# EAGLE design Hometech2 (EAGLE 5.12)
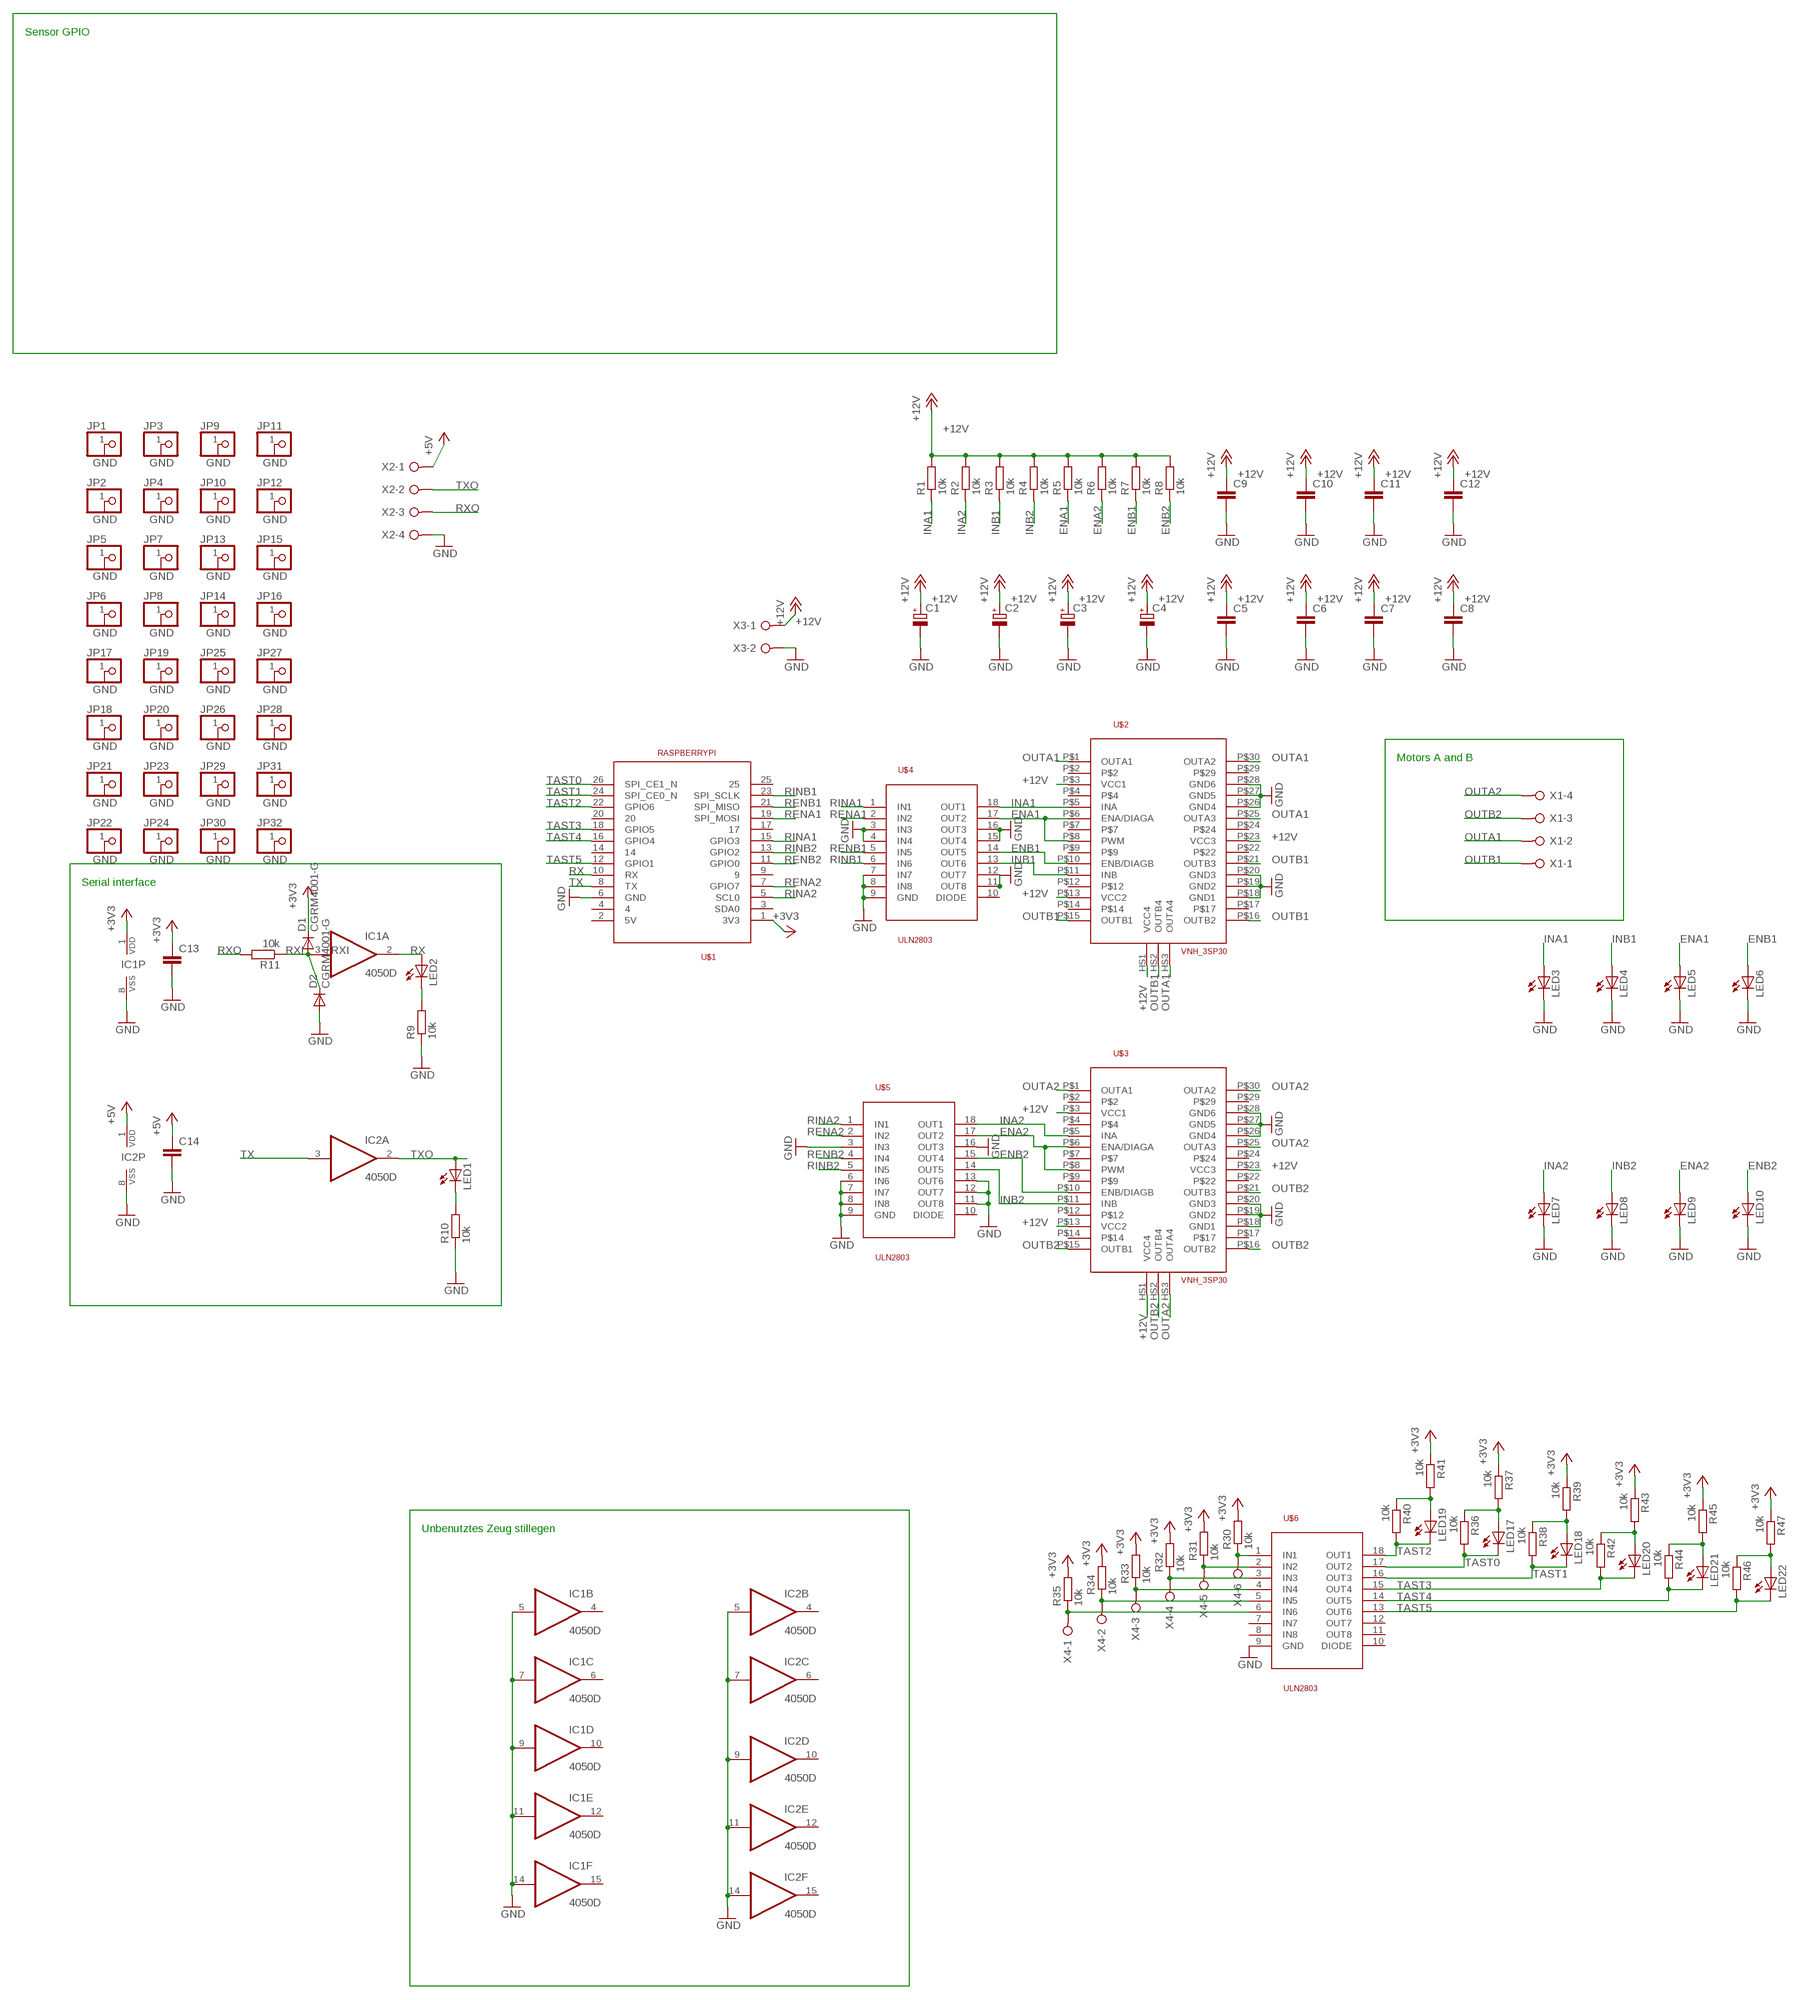
[diagram p0: schematic, sheet 1]

## Parts
C1  CPOL-EUE5-10.5  [E5-10,5]
C2  CPOL-EUE5-10.5  [E5-10,5]
C3  CPOL-EUE5-10.5  [E5-10,5]
C4  CPOL-EUE5-10.5  [E5-10,5]
C5  C-EUC1206  [C1206]
C6  C-EUC1206  [C1206]
C7  C-EUC1206  [C1206]
C8  C-EUC1206  [C1206]
C9  C-EUC1206  [C1206]
C10  C-EUC1206  [C1206]
C11  C-EUC1206  [C1206]
C12  C-EUC1206  [C1206]
C13  C-EUC1206  [C1206]
C14  C-EUC1206  [C1206]
D1  CGRM4001-G  [SOD-123_MINI-SMA]
D2  CGRM4001-G  [SOD-123_MINI-SMA]
IC1  4050D  [SO16]
IC2  4050D  [SO16]
JP1  PINHD-1X1  [1X01]
JP2  PINHD-1X1  [1X01]
JP3  PINHD-1X1  [1X01]
JP4  PINHD-1X1  [1X01]
JP5  PINHD-1X1  [1X01]
JP6  PINHD-1X1  [1X01]
JP7  PINHD-1X1  [1X01]
JP8  PINHD-1X1  [1X01]
JP9  PINHD-1X1  [1X01]
JP10  PINHD-1X1  [1X01]
JP11  PINHD-1X1  [1X01]
JP12  PINHD-1X1  [1X01]
JP13  PINHD-1X1  [1X01]
JP14  PINHD-1X1  [1X01]
JP15  PINHD-1X1  [1X01]
JP16  PINHD-1X1  [1X01]
JP17  PINHD-1X1  [1X01]
JP18  PINHD-1X1  [1X01]
JP19  PINHD-1X1  [1X01]
JP20  PINHD-1X1  [1X01]
JP21  PINHD-1X1  [1X01]
JP22  PINHD-1X1  [1X01]
JP23  PINHD-1X1  [1X01]
JP24  PINHD-1X1  [1X01]
JP25  PINHD-1X1  [1X01]
JP26  PINHD-1X1  [1X01]
JP27  PINHD-1X1  [1X01]
JP28  PINHD-1X1  [1X01]
JP29  PINHD-1X1  [1X01]
JP30  PINHD-1X1  [1X01]
JP31  PINHD-1X1  [1X01]
JP32  PINHD-1X1  [1X01]
LED1  LEDCHIPLED_1206  [CHIPLED_1206]
LED2  LEDCHIPLED_1206  [CHIPLED_1206]
LED3  LEDCHIPLED_1206  [CHIPLED_1206]
LED4  LEDCHIPLED_1206  [CHIPLED_1206]
LED5  LEDCHIPLED_1206  [CHIPLED_1206]
LED6  LEDCHIPLED_1206  [CHIPLED_1206]
LED7  LEDCHIPLED_1206  [CHIPLED_1206]
LED8  LEDCHIPLED_1206  [CHIPLED_1206]
LED9  LEDCHIPLED_1206  [CHIPLED_1206]
LED10  LEDCHIPLED_1206  [CHIPLED_1206]
LED17  LEDCHIPLED_1206  [CHIPLED_1206]
LED18  LEDCHIPLED_1206  [CHIPLED_1206]
LED19  LEDCHIPLED_1206  [CHIPLED_1206]
LED20  LEDCHIPLED_1206  [CHIPLED_1206]
LED21  LEDCHIPLED_1206  [CHIPLED_1206]
LED22  LEDCHIPLED_1206  [CHIPLED_1206]
R1  10k  R-EU_R1206  [R1206]
R2  10k  R-EU_R1206  [R1206]
R3  10k  R-EU_R1206  [R1206]
R4  10k  R-EU_R1206  [R1206]
R5  10k  R-EU_R1206  [R1206]
R6  10k  R-EU_R1206  [R1206]
R7  10k  R-EU_R1206  [R1206]
R8  10k  R-EU_R1206  [R1206]
R9  10k  R-EU_R1206  [R1206]
R10  10k  R-EU_R1206  [R1206]
R11  10k  R-EU_R1206  [R1206]
R30  10k  R-EU_R1206  [R1206]
R31  10k  R-EU_R1206  [R1206]
R32  10k  R-EU_R1206  [R1206]
R33  10k  R-EU_R1206  [R1206]
R34  10k  R-EU_R1206  [R1206]
R35  10k  R-EU_R1206  [R1206]
R36  10k  R-EU_R1206  [R1206]
R37  10k  R-EU_R1206  [R1206]
R38  10k  R-EU_R1206  [R1206]
R39  10k  R-EU_R1206  [R1206]
R40  10k  R-EU_R1206  [R1206]
R41  10k  R-EU_R1206  [R1206]
R42  10k  R-EU_R1206  [R1206]
R43  10k  R-EU_R1206  [R1206]
R44  10k  R-EU_R1206  [R1206]
R45  10k  R-EU_R1206  [R1206]
R46  10k  R-EU_R1206  [R1206]
R47  10k  R-EU_R1206  [R1206]
U$1  RASPBERRYPI  [ML26]
U$2  VNH_3SP30  [POWERSO30]
U$3  VNH_3SP30  [POWERSO30]
U$4  ULN2803  [SO18L]
U$5  ULN2803  [SO18L]
U$6  ULN2803  [SO18L]
X1  W237-04P  [W237-4P]
X2  W237-04P  [W237-4P]
X3  W237-02P  [W237-132]
X4  W237-06P  [W237-6P]

## Nets
+3V3: C13.1 D1.C IC1.1(P:VDD) R30.2 R31.2 R32.2 R33.2 R34.2 R35.2 R37.1 R39.1 R41.1 R43.1 R45.1 R47.1 U$1.1(3V3)
+5V: C14.1 IC2.1(P:VDD) X2.1
+12V: C1.+ C2.+ C3.+ C4.+ C5.1 C6.1 C7.1 C8.1 C9.1 C10.1 C11.1 C12.1 R1.2 R2.2 R3.2 R4.2 R5.2 R6.2 R7.2 R8.2 U$2.HS1(VCC4) U$2.P$3(VCC1) U$2.P$13(VCC2) U$2.P$23(VCC3) U$3.HS1(VCC4) U$3.P$3(VCC1) U$3.P$13(VCC2) U$3.P$23(VCC3) X3.1
ENA1: LED5.A R5.1 U$2.P$6(ENA/DIAGA) U$2.P$8(PWM) U$4.17(OUT2)
ENA2: LED9.A R6.1 U$3.P$6(ENA/DIAGA) U$3.P$8(PWM) U$5.17(OUT2)
ENB1: LED6.A R7.1 U$2.P$10(ENB/DIAGB) U$4.14(OUT5)
ENB2: LED10.A R8.1 U$3.P$10(ENB/DIAGB) U$5.15(OUT4)
GND: C1.- C2.- C3.- C4.- C5.2 C6.2 C7.2 C8.2 C9.2 C10.2 C11.2 C12.2 C13.2 C14.2 D2.A IC1.5(B:I) IC1.7(C:I) IC1.8(P:VSS) IC1.9(D:I) IC1.11(E:I) IC1.14(F:I) IC2.5(B:I) IC2.7(C:I) IC2.8(P:VSS) IC2.9(D:I) IC2.11(E:I) IC2.14(F:I) JP1.1 JP2.1 JP3.1 JP4.1 JP5.1 JP6.1 JP7.1 JP8.1 JP9.1 JP10.1 JP11.1 JP12.1 JP13.1 JP14.1 JP15.1 JP16.1 JP17.1 JP18.1 JP19.1 JP20.1 JP21.1 JP22.1 JP23.1 JP24.1 JP25.1 JP26.1 JP27.1 JP28.1 JP29.1 JP30.1 JP31.1 JP32.1 LED3.C LED4.C LED5.C LED6.C LED7.C LED8.C LED9.C LED10.C R9.1 R10.1 U$1.6(GND) U$2.P$18(GND1) U$2.P$19(GND2) U$2.P$20(GND3) U$2.P$26(GND4) U$2.P$27(GND5) U$2.P$28(GND6) U$3.P$18(GND1) U$3.P$19(GND2) U$3.P$20(GND3) U$3.P$26(GND4) U$3.P$27(GND5) U$3.P$28(GND6) U$4.3(IN3) U$4.4(IN4) U$4.7(IN7) U$4.8(IN8) U$4.9(GND) U$4.11(OUT8) U$4.12(OUT7) U$4.15(OUT4) U$4.16(OUT3) U$5.3(IN3) U$5.6(IN6) U$5.7(IN7) U$5.8(IN8) U$5.9(GND) U$5.11(OUT8) U$5.12(OUT7) U$5.13(OUT6) U$5.16(OUT3) U$6.9(GND) X2.4 X3.2
INA1: LED3.A R1.1 U$2.P$5(INA) U$4.18(OUT1)
INA2: LED7.A R2.1 U$3.P$5(INA) U$5.18(OUT1)
INB1: LED4.A R3.1 U$2.P$11(INB) U$4.13(OUT6)
INB2: LED8.A R4.1 U$3.P$11(INB) U$5.14(OUT5)
N$4: LED2.C R9.2
N$5: LED1.C R10.2
N$28: R30.1 U$6.1(IN1) X4.6
N$29: R31.1 U$6.2(IN2) X4.5
N$30: R32.1 U$6.3(IN3) X4.4
N$31: R33.1 U$6.4(IN4) X4.3
N$32: R34.1 U$6.5(IN5) X4.2
N$33: R35.1 U$6.6(IN6) X4.1
N$34: LED17.A R36.1 R37.2
N$36: LED18.A R38.1 R39.2
N$38: LED19.A R40.1 R41.2
N$40: LED20.A R42.1 R43.2
N$42: LED21.A R44.1 R45.2
N$44: LED22.A R46.1 R47.2
OUTA1: U$2.HS3(OUTA4) U$2.P$1(OUTA1) U$2.P$25(OUTA3) U$2.P$30(OUTA2) X1.2
OUTA2: U$3.HS3(OUTA4) U$3.P$1(OUTA1) U$3.P$25(OUTA3) U$3.P$30(OUTA2) X1.4
OUTB1: U$2.HS2(OUTB4) U$2.P$15(OUTB1) U$2.P$16(OUTB2) U$2.P$21(OUTB3) X1.1
OUTB2: U$3.HS2(OUTB4) U$3.P$15(OUTB1) U$3.P$16(OUTB2) U$3.P$21(OUTB3) X1.3
RENA1: U$1.19(SPI_MOSI) U$4.2(IN2)
RENA2: U$1.7(GPIO7) U$5.2(IN2)
RENB1: U$1.21(SPI_MISO) U$4.5(IN5)
RENB2: U$1.11(GPIO0) U$5.4(IN4)
RINA1: U$1.15(GPIO3) U$4.1(IN1)
RINA2: U$1.5(SCL0) U$5.1(IN1)
RINB1: U$1.23(SPI_SCLK) U$4.6(IN6)
RINB2: U$1.13(GPIO2) U$5.5(IN5)
RX: IC1.2(A:O) LED2.A U$1.10(RX)
RXI: D1.A D2.C IC1.3(A:I) R11.1
RXO: R11.2 X2.3
TAST0: LED17.C R36.2 U$1.26(SPI_CE1_N) U$6.17(OUT2)
TAST1: LED18.C R38.2 U$1.24(SPI_CE0_N) U$6.16(OUT3)
TAST2: LED19.C R40.2 U$1.22(GPIO6) U$6.18(OUT1)
TAST3: LED20.C R42.2 U$1.18(GPIO5) U$6.15(OUT4)
TAST4: LED21.C R44.2 U$1.16(GPIO4) U$6.14(OUT5)
TAST5: LED22.C R46.2 U$1.12(GPIO1) U$6.13(OUT6)
TX: IC2.3(A:I) U$1.8(TX)
TXO: IC2.2(A:O) LED1.A X2.2
Unconnected: IC1.4(B:O) IC1.6(C:O) IC1.10(D:O) IC1.12(E:O) IC1.15(F:O) IC2.4(B:O) IC2.6(C:O) IC2.10(D:O) IC2.12(E:O) IC2.15(F:O) U$1.2(5V) U$1.3(SDA0) U$1.4 U$1.9 U$1.14 U$1.17 U$1.20 U$1.25 U$2.P$2 U$2.P$4 U$2.P$7 U$2.P$9 U$2.P$12 U$2.P$14 U$2.P$17 U$2.P$22 U$2.P$24 U$2.P$29 U$3.P$2 U$3.P$4 U$3.P$7 U$3.P$9 U$3.P$12 U$3.P$14 U$3.P$17 U$3.P$22 U$3.P$24 U$3.P$29 U$4.10(DIODE) U$5.10(DIODE) U$6.7(IN7) U$6.8(IN8) U$6.10(DIODE) U$6.11(OUT8) U$6.12(OUT7)

## Notes on the sheet
- Sensor GPIO
- Motors A and B
- Serial interface
- Unbenutztes Zeug stillegen

## Library data of the parts
C1-C4 = rcl:CPOL-EU: POLARIZED CAPACITOR, European symbol
C5-C14 = rcl:C-EU: CAPACITOR, European symbol
D1 D2 = diode:CGRM400*-G: Molded plasitc,JEDEC SOD-123/Mini SMA Source: Comchip CGRM4001-G.pdf
IC1 IC2 = 40xx:4050: Hex non-inverting BUFFER
JP1-JP32 = via:PINHD-1X1: VIA
LED1-LED10 LED17-LED22 = led:LED: LED OSRAM: - CHIPLED LG R971, LG N971, LY N971, LG Q971, LY Q971, LO R971, LY R971 LH N974, LH R974 LS Q976, LO Q976, LY Q976 LO Q996 - Hyper CHIPLED LW Q18S LB Q993, LB Q99A, LB R99A - SideLED LS A670, LO A670, LY A670, LG A670, LP A670 LB A673, LV A673, LT A673, LW A673 LH A674 LY A675 LS A676, LA A676, LO A676, LY A676, LW A676 LS A679, LY A679, LG A679 - Hyper Micro SIDELED® LS Y876, LA Y876, LO Y876, LY Y876 LT Y87S - SmartLED LW L88C, LW L88S LB L89C, LB L89S, LG L890 LS L89K, LO L89K, LY L89K LS L896, LA L896, LO L896, LY L896 - TOPLED LS T670, LO T670, LY T670, LG T670, LP T670 LSG T670, LSP T670, LSY T670, LOP T670, LYG T670 LG T671, LOG T671, LSG T671 LB T673, LV T673, LT T673, LW T673 LH T674 LS T676, LA T676, LO T676, LY T676, LB T676, LH T676, LSB T676, LW T676 LB T67C, LV T67C, LT T67C, LS T67K, LO T67K, LY T67K, LW E67C LS E67B, LA E67B, LO E67B, LY E67B, LB E67C, LV E67C, LT E67C LW T67C LS T679, LY T679, LG T679 LS T770, LO T770, LY T770, LG T770, LP T770 LB T773, LV T773, LT T773, LW T773 LH T774 LS E675, LA E675, LY E675, LS T675 LS T776, LA T776, LO T776, LY T776, LB T776 LHGB T686 LT T68C, LB T68C - Hyper Mini TOPLED® LB M676 - Mini TOPLED Santana® LG M470 LS M47K, LO M47K, LY M47K Source: http://www.osram.convergy.de LUXEON: - LUMILED® LXK2-PW12-R00, LXK2-PW12-S00, LXK2-PW14-U00, LXK2-PW14-V00 LXK2-PM12-R00, LXK2-PM12-S00, LXK2-PM14-U00 LXK2-PE12-Q00, LXK2-PE12-R00, LXK2-PE12-S00, LXK2-PE14-T00, LXK2-PE14-U00 LXK2-PB12-K00, LXK2-PB12-L00, LXK2-PB12-M00, LXK2-PB14-N00, LXK2-PB14-P00, LXK2-PB14-Q00 LXK2-PR12-L00, LXK2-PR12-M00, LXK2-PR14-Q00, LXK2-PR14-R00 LXK2-PD12-Q00, LXK2-PD12-R00, LXK2-PD12-S00 LXK2-PH12-R00, LXK2-PH12-S00 LXK2-PL12-P00, LXK2-PL12-Q00, LXK2-PL12-R00 Source: www.luxeon.com KINGBRIGHT: KA-3528ASYC Source: www.kingbright.com
R1-R11 R30-R47 = rcl:R-EU_: RESISTOR, European symbol
U$1 = raspberrypi:RASPBERRYPI
U$2 U$3 = VNH 3SP30 :: Full-Bridge Motor Driver:VNH_3SP30
U$4-U$6 = uln2803:ULN2803
X1 X2 = con-wago-508:W237-04P: WAGO SREW CLAMP; OC_FARNELL: unknown; OC_NEWARK: unknown
X3 = con-wago-508:W237-02P: WAGO SREW CLAMP; OC_FARNELL: unknown; OC_NEWARK: unknown
X4 = con-wago-508:W237-06P: WAGO SREW CLAMP; OC_FARNELL: unknown; OC_NEWARK: unknown

## Board
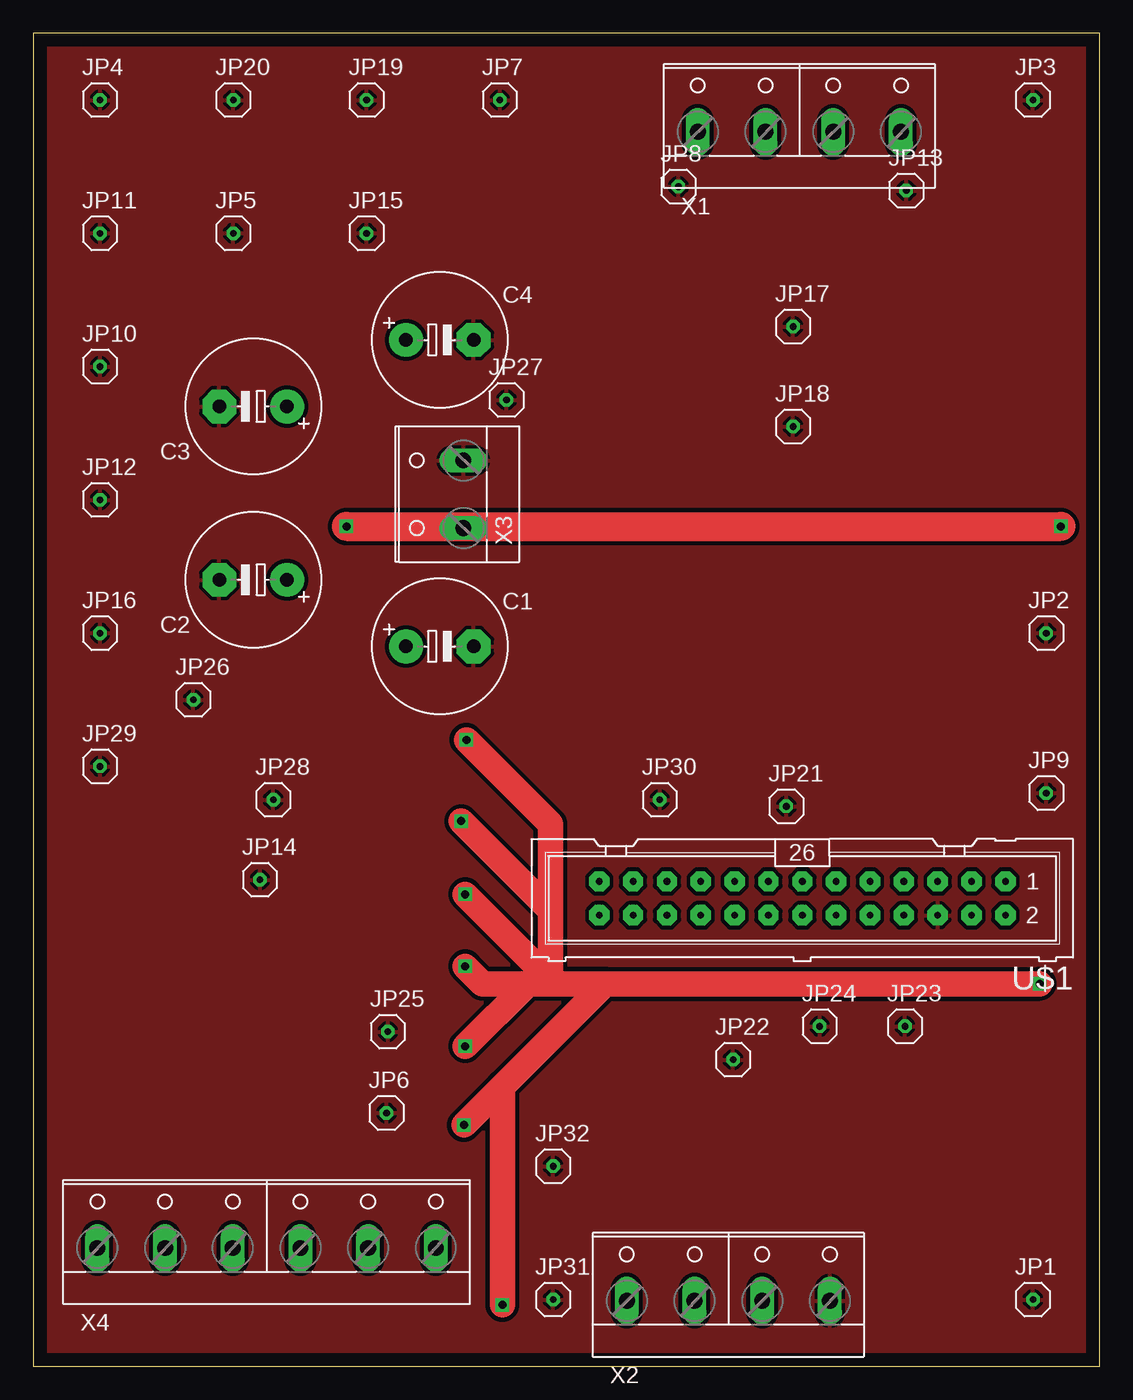
[diagram p1: board, top side]
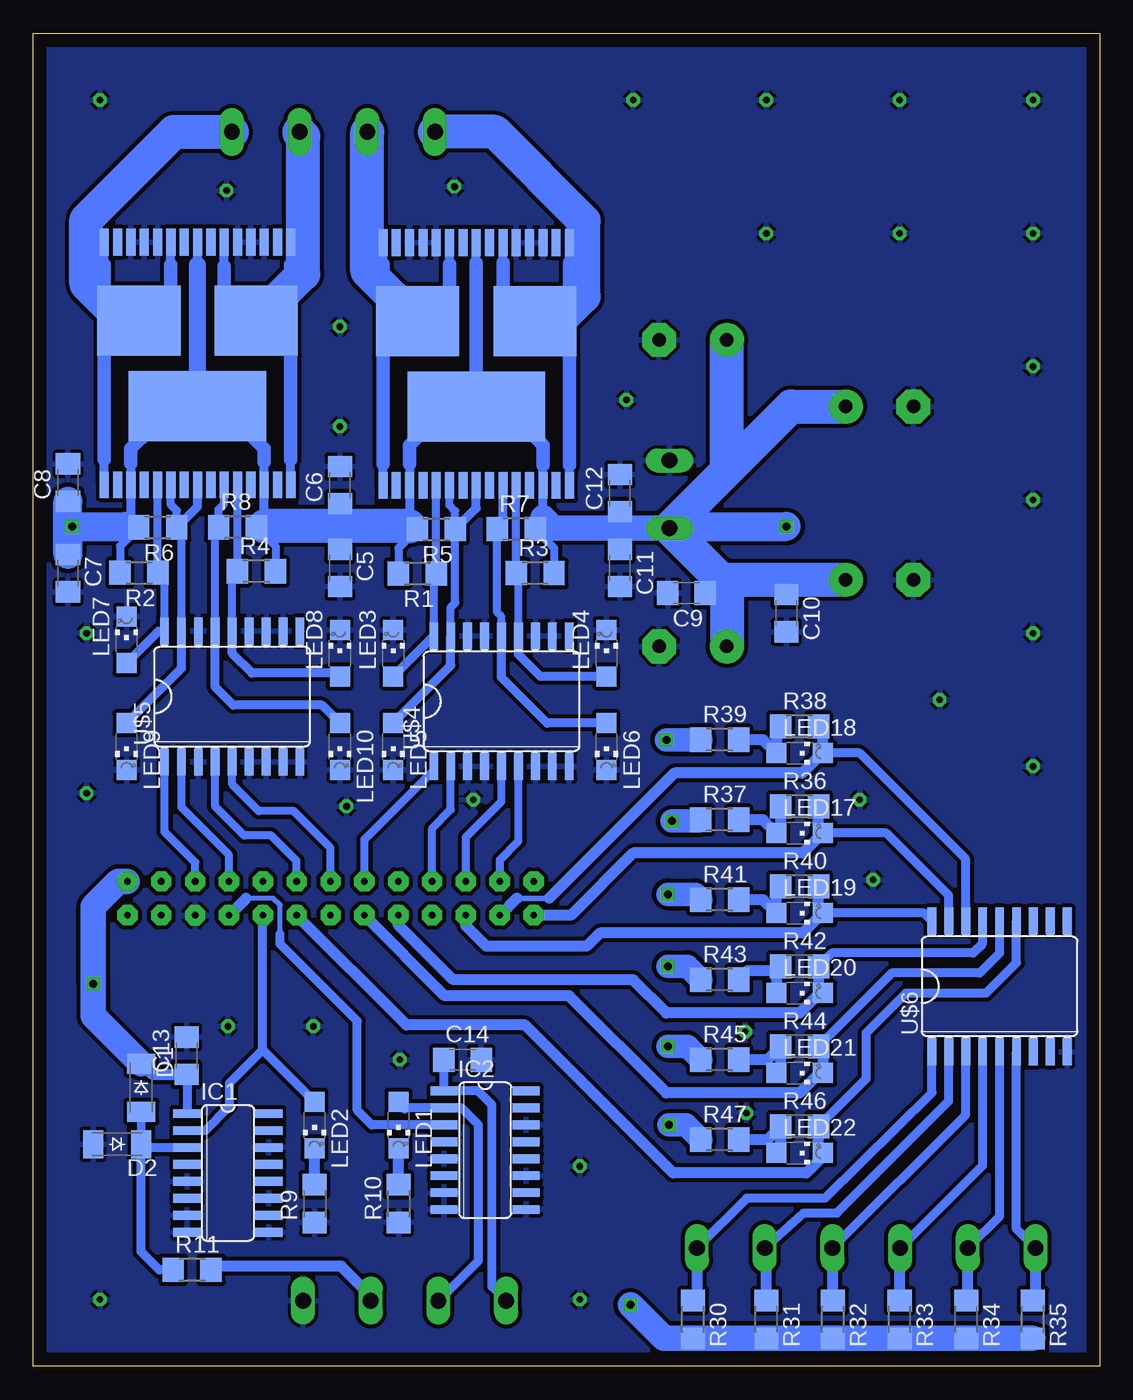
[diagram p2: board, bottom side, seen from below]

Size 80 x 100 mm. Coordinates in mm from the lower left corner, seen from the top.
Outline: 0,0 80,0 80,100 0,100 0,0
Copper layers (1*16): Top 0.035mm / dielectric 1.5mm / Bottom 0.035mm
Design rules "default *": minimum track width 12mil, minimum drill 4mil, track to track 12mil, track to pad 12mil, pad to pad 12mil, via to via 12mil, smd to smd 12mil, copper to edge 40mil, drill to drill 12mil, minimum pad ring 10mil, minimum via ring 8mil, stop-mask expansion 4mil, vias tented up to drill 0mil, thermal gap 10mil

### Footprints (pad centres in the part's own frame; a part is rotated, then mirrored left to right if it is on the bottom)
E5-10,5 = drill 1.016 pad 2.54 round: + -2.54,0 | drill 1.016 pad 2.54 octagon: - 2.54,0
C1206 = smd 1.6 x 1.8: 1 -1.4,0; 2 1.4,0
SOD-123_MINI-SMA = smd 1.5 x 2.1: A 1.8,0; C -1.8,0
SO16 = smd 0.66 x 2.032: 1 -4.445,-3.073; 2 -3.175,-3.073; 3 -1.905,-3.073; 4 -0.635,-3.073; 5 0.635,-3.073; 6 1.905,-3.073; 7 3.175,-3.073; 8 4.445,-3.073; 9 4.445,3.073; 10 3.175,3.073; 11 1.905,3.073; 12 0.635,3.073; 13 -0.635,3.073; 14 -1.905,3.073; 15 -3.175,3.073; 16 -4.445,3.073
1X01 = drill 0.5 octagon: 1 0,0
CHIPLED_1206 = smd 1.5 x 1.5: A 0,-1.75; C 0,1.75
R1206 = smd 1.6 x 1.803: 1 -1.422,0; 2 1.422,0
ML26 = drill 0.5 pad 1.524 octagon: 1 -15.24,-1.27; 2 -15.24,1.27; 3 -12.7,-1.27; 4 -12.7,1.27; 5 -10.16,-1.27; 6 -10.16,1.27; 7 -7.62,-1.27; 8 -7.62,1.27; 9 -5.08,-1.27; 10 -5.08,1.27; 11 -2.54,-1.27; 12 -2.54,1.27; 13 0,-1.27; 14 0,1.27; 15 2.54,-1.27; 16 2.54,1.27; 17 5.08,-1.27; 18 5.08,1.27; 19 7.62,-1.27; 20 7.62,1.27; 21 10.16,-1.27; 22 10.16,1.27; 23 12.7,-1.27; 24 12.7,1.27; 25 15.24,-1.27; 26 15.24,1.27
POWERSO30 = smd 5.25 x 10.3: HS1 -3.2,0 | smd 5.25 x 6.23: HS2 3.2,-4.4; HS3 3.2,4.4 | smd 2 x 0.68: P$1 -9.1,7; P$2 -9.1,6; P$3 -9.1,5; P$4 -9.1,4; P$5 -9.1,3; P$6 -9.1,2; P$7 -9.1,1; P$8 -9.1,0; P$9 -9.1,-1; P$10 -9.1,-2; P$11 -9.1,-3; P$12 -9.1,-4; P$13 -9.1,-5; P$14 -9.1,-6; P$15 -9.1,-7; P$16 9.1,-7; P$17 9.1,-6; P$18 9.1,-5; P$19 9.1,-4; P$20 9.1,-3; P$21 9.1,-2; P$22 9.1,-1; P$23 9.1,0; P$24 9.1,1; P$25 9.1,2; P$26 9.1,3; P$27 9.1,4; P$28 9.1,5; P$29 9.1,6; P$30 9.1,7
SO18L = smd 0.66 x 2.032: 1 -5.08,-4.902; 2 -3.81,-4.902; 3 -2.54,-4.902; 4 -1.27,-4.902; 5 0,-4.902; 6 1.27,-4.902; 7 2.54,-4.902; 8 3.81,-4.902; 9 5.08,-4.902; 10 5.08,4.902; 11 3.81,4.902; 12 2.54,4.902; 13 1.27,4.902; 14 0,4.902; 15 -1.27,4.902; 16 -2.54,4.902; 17 -3.81,4.902; 18 -5.08,4.902
W237-4P = drill 1.194 long: 1 -7.62,-0.635; 2 -2.54,-0.635; 3 2.54,-0.635; 4 7.62,-0.635
W237-132 = drill 1.194 long: 1 -2.54,-0.635; 2 2.54,-0.635
W237-6P = drill 1.194 long: 1 -12.7,-0.635; 2 -7.62,-0.635; 3 -2.54,-0.635; 4 2.54,-0.635; 5 7.62,-0.635; 6 12.7,-0.635

### Placement (x,y rotation side)
C1  30.5,54 0 top
C2  16.5,59 180 top
C3  16.5,72 180 top
C4  30.5,77 0 top
C5  57,59.9 270 bottom
C6  57,66.1 90 bottom
C7  77.4,59.5 270 bottom
C8  77.4,66.3 90 bottom
C9  31,58 180 bottom
C10  23.5,56.5 270 bottom
C11  36,59.9 270 bottom
C12  36,65.5 90 bottom
C13  68.5,23.3 90 bottom
C14  47.8,23 0 bottom
D1  71.9,20.9 270 bottom
D2  73.71,16.66 180 bottom
IC1  65.4,14.5 270 bottom
IC2  46.1,16.2 270 bottom
JP1  75,5 0 top
JP2  76,55 0 top
JP3  75,95 0 top
JP4  5,95 0 top
JP5  15,85 0 top
JP6  26.5,19 0 top
JP7  35,95 0 top
JP8  48.4,88.5 0 top
JP9  76,43 0 top
JP10  5,75 0 top
JP11  5,85 0 top
JP12  5,65 0 top
JP13  65.5,88.2 0 top
JP14  17,36.5 0 top
JP15  25,85 0 top
JP16  5,55 0 top
JP17  57,78 0 top
JP18  57,70.5 0 top
JP19  25,95 0 top
JP20  15,95 0 top
JP21  56.5,42 0 top
JP22  52.5,23 0 top
JP23  65.4,25.5 0 top
JP24  59,25.5 0 top
JP25  26.6,25.1 0 top
JP26  12,50 0 top
JP27  35.5,72.5 0 top
JP28  18,42.5 0 top
JP29  5,45 0 top
JP30  47,42.5 0 top
JP31  39,5 0 top
JP32  39,15 0 top
LED1  52.6,18.1 180 bottom
LED2  58.9,18.1 180 bottom
LED3  53,53.5 0 bottom
LED4  37,53.5 0 bottom
LED5  53,46.5 180 bottom
LED6  37,46.5 180 bottom
LED7  73,54.5 0 bottom
LED8  57,53.5 0 bottom
LED9  73,46.5 180 bottom
LED10  57,46.5 180 bottom
LED17  22.5,40 270 bottom
LED18  22.5,46 270 bottom
LED19  22.5,34 270 bottom
LED20  22.5,28 270 bottom
LED21  22.5,22 270 bottom
LED22  22.5,16 270 bottom
R1  51.19,59.48 180 bottom
R2  72.08,59.54 180 bottom
R3  42.35,59.49 0 bottom
R4  63.26,59.64 0 bottom
R5  49.77,62.79 180 bottom
R6  70.67,62.94 180 bottom
R7  43.77,62.79 0 bottom
R8  64.68,62.94 0 bottom
R9  58.9,12.2 90 bottom
R10  52.6,12.2 90 bottom
R11  68.09,7.23 0 bottom
R30  30.5,3.5 270 bottom
R31  25,3.5 270 bottom
R32  20,3.5 270 bottom
R33  15,3.5 270 bottom
R34  10,3.5 270 bottom
R35  5,3.5 270 bottom
R36  22.5,42 0 bottom
R37  28.5,41 0 bottom
R38  22.5,48 0 bottom
R39  28.5,47 0 bottom
R40  22.5,36 0 bottom
R41  28.5,35 0 bottom
R42  22.5,30 0 bottom
R43  28.5,29 0 bottom
R44  22.5,24 0 bottom
R45  28.5,23 0 bottom
R46  22.5,18 0 bottom
R47  28.5,17 0 bottom
U$1  57.7,35.1 180 top
U$2  46.77,75.19 90 bottom
U$3  67.68,75.24 90 bottom
U$4  44.87,49.89 0 bottom
U$5  65.08,50.24 0 bottom
U$6  7.5,28.5 0 bottom
X1  57.48,93.24 0 top
X2  52.15,5.55 0 top
X3  31.63,65.42 90 top
X4  17.5,9.5 0 top

### Tracks (layer width: path | path; a pad name or v marks a point on that pad's centre or on a via)
+3V3  (via drill 0.6)
  Top 0.813: 39.1,28.7 38.8,28.7
  Top 1.93: 35.2,21 v32.3,18.1 | 42.9,28.7 40.4,26.2 35.2,21 | 42.9,28.7 v75.5,28.7 | 37.1,28.7 v32.4,24 | 37.1,28.7 38.8,28.7 38.8,34.2 | v32.4,30 33.7,28.7 37.1,28.7 | v32.4,35.4 39.1,28.7 42.9,28.7 | 38.8,34.2 v32.1,40.9 | v32.5,47 38.8,40.7 38.8,34.2 | v35.2,4.6 35.2,21
  Bottom 0.68: 68.47,21.87 IC1.1
  Bottom 0.813: 68.47,21.87 C13.1 71.1,21.9 D1.C | 30.02,40.9 R37.1
  Bottom 1.778: R47.1 31.02,18.1 v32.3,18.1 | R45.1 30.92,24 v32.4,24 | R43.1 30.92,30 v32.4,30 | R41.1 30.32,35.4 v32.4,35.4 | v32.1,40.9 30.02,40.9 | v32.5,47 R39.1
  Bottom 1.93: D1.C 75.5,26.3 v75.5,28.7 75.5,34.5 73.63,36.37 U$1.1 | R35.2 R34.2 R33.2 R32.2 R31.2 R30.2 32.68,2.08 v35.2,4.6
+5V
  Bottom 0.68: X2.1 45.6,5.99 45.6,19.6 46.65,20.64 IC2.1 49.17,23.17
  Bottom 0.813: 49.17,23.17 C14.1
+12V  (via drill 0.6)
  Top 2.184: v23.5,63 v77.1,63
  Bottom 0.406: 23.5,59 C10.1 | C9.1 28.46,58 27.96,58.5
  Bottom 0.61: R1.2 52.61,61.37 R5.2 | R3.2 40.93,61.37 R7.2 | R4.2 61.84,61.52 R8.2 | R2.2 73.5,61.54 R6.2
  Bottom 0.68: 62.68,63.02 U$3.P$13 62.68,67.84 | 62.68,63.02 62.68,62.94 | 67.68,82.64 U$3.P$23 | 51.77,67.69 U$2.P$3 51.77,63.02 51.77,62.79 R5.2 | 46.77,80.62 U$2.P$23 | 72.68,67.74 U$3.P$3 72.68,62.94 R6.2 | 62.68,63.02 63.17,63.02 R8.2 | 41.77,67.59 U$2.P$13 41.77,63.66 41.77,62.79 R7.2 | 47.38,71.38 46.77,70.77
  Bottom 0.813: C11.1 36,62.38 36.5,62.88 | C12.1 36,62.98 36.1,62.88 | C5.1 57,62.92 57.1,63.02 57,63.12 C6.1
  Bottom 1.016: 62.68,67.84 62.68,68.84 65.68,71.84 67.48,71.84 U$3.HS1 69.48,70.24 71.28,70.24 72.68,68.84 72.68,67.74 | 51.77,67.69 51.77,69.09 49.67,71.19 47.57,71.19 47.38,71.38 U$2.HS1 | 41.77,67.59 41.77,69.09 44.37,71.69 46.47,71.69 U$2.HS1 | U$2.HS1 46.77,80.62 46.77,82.79
  Bottom 1.27: U$3.HS1 67.68,82.64
  Bottom 1.93: X3.1 36.1,62.88 36.5,62.88 40.99,62.88 41.77,63.66
  Bottom 2.184: C8.1 C7.1 77.4,62.1 v77.1,63 73.1,63 | v23.5,63 32.15,63 X3.1
  Bottom 2.54: 51.77,63.02 57.1,63.02 62.68,63.02 | C1.+ 27.96,58.5 27.96,58.58 28.39,59 | 27.96,67.19 C4.+ | 27.96,67.19 X3.1 28.39,59 | C3.+ 23.14,72 27.96,67.19 | C2.+ 23.5,59 28.39,59
ENA1
  Bottom 0.61: U$4.17 48.68,56.92 48.34,57.26 R5.1 48.35,64.17 48.77,64.59 U$2.P$6
  Bottom 0.68: LED5.A 48.68,52.57 U$4.17 | U$2.P$8 46.77,64.37 R5.1
ENA2
  Bottom 0.61: U$3.P$6 69.68,64.64 69.24,64.2 69.24,62.95 R6.1 68.89,62.57 U$5.17
  Bottom 0.68: LED9.A 68.89,52.36 U$5.17 | U$3.P$8 67.68,64.5 R6.1
ENB1
  Bottom 0.406: R7.1 44.77,62.79
  Bottom 0.61: R7.1 45.19,56.55 44.87,56.23 U$4.14
  Bottom 0.68: 44.77,62.79 U$2.P$10 | LED6.A 41.45,48.25 44.87,51.67 U$4.14
ENB2
  Bottom 0.61: U$3.P$10 65.69,66.13 65.69,64.7 66.1,64.28 R8.1 66.35,62.69 U$5.15
  Bottom 0.68: LED10.A 58.35,49.6 65,49.6 66.35,50.95 U$5.15
GND
  pour Bottom: 0,0 80,0 80,100 0,100
  pour Top: 0,0 0,100 80,100 80,0
INA1
  Bottom 0.61: U$4.18 49.95,59.39 R1.1 U$2.P$5
  Bottom 0.68: LED3.A U$4.18
INA2
  Bottom 0.61: U$3.P$5 70.66,66.11 R2.1 70.16,59.04 U$5.18
  Bottom 0.68: LED7.A 70.61,55.14 U$5.18
INB1
  Bottom 0.61: U$2.P$11 R3.1 43.6,59.32 U$4.13
  Bottom 0.68: LED4.A 41.95,51.75 43.6,53.4 U$4.13
INB2
  Bottom 0.61: U$3.P$11 R4.1 65.08,59.24 U$5.14
  Bottom 0.68: LED8.A 57.25,52 63.6,52 65.08,53.48 U$5.14
N$4
  Bottom 0.813: R9.2 LED2.C
N$5
  Bottom 0.813: R10.2 LED1.C
N$28
  Bottom 0.68: X4.6 26.46,12.6 20.6,12.6 12.58,20.52 U$6.1
  Bottom 0.813: R30.1 30.2,5.22 X4.6
N$29
  Bottom 0.68: X4.5 22.18,11.5 19.7,11.5 11.31,19.89 U$6.2
  Bottom 0.813: X4.5 25,8.74 R31.1
N$30
  Bottom 0.68: X4.4 10.04,18.86 U$6.3
  Bottom 0.813: X4.4 20,8.82 R32.1
N$31
  Bottom 0.68: X4.3 8.77,15.05 U$6.4
  Bottom 0.813: X4.3 15,8.82 R33.1
N$32
  Bottom 0.68: X4.2 7.5,11.24 U$6.5
  Bottom 0.813: R34.1 9.88,5.04 X4.2
N$33
  Bottom 0.68: X4.1 6.23,10.29 U$6.6
  Bottom 0.813: R35.1 4.8,5.12 X4.1
N$34
  Bottom 0.813: R36.1 23.92,40.33 LED17.A 25.25,41 R37.2
N$36
  Bottom 0.813: R38.1 24.25,47.67 LED18.A 25.25,47 R39.2
N$38
  Bottom 0.813: R40.1 24.25,35.67 LED19.A 25.25,35 R41.2
N$40
  Bottom 0.813: 24.25,29.67 LED20.A | R42.1 24.25,29.67 | 24.25,29.67 26.41,29.67 R43.2
N$42
  Bottom 0.813: LED21.A 23.92,22.33 R44.1 24.92,23 R45.2
N$44
  Bottom 0.813: LED22.A 23.92,16.33 R46.1 24.92,17 R47.2
OUTA1
  Bottom 0.68: 53.77,82.69 U$2.P$30 | 48.77,82.69 U$2.P$25 | U$2.P$1 53.77,67.69
  Bottom 1.016: 48.77,82.69 48.77,78.39 U$2.HS3 53.77,78.39 | 53.77,78.39 53.77,82.69 | 53.77,67.69 53.77,78.39
  Bottom 2.54: X1.2 54.94,82.16 U$2.HS3
OUTA2
  Bottom 0.68: 74.68,82.64 U$3.P$30 | 69.68,82.64 U$3.P$25 | U$3.P$1 74.68,68.04
  Bottom 1.016: 74.68,68.04 74.68,77.74 74.48,77.94 73.48,77.94 | 73.48,77.94 72.58,77.94 U$3.HS3 71.58,78.94 70.78,78.94 69.68,80.04 69.68,82.64 | 74.68,82.64 74.68,79.84 73.58,78.74 73.58,78.04 73.48,77.94
  Bottom 2.54: X1.4 69.44,92.61 76.03,86.01 76.03,81.19 73.58,78.74
OUTB1
  Bottom 0.68: 44.77,82.79 U$2.P$21 | U$2.P$15 39.77,67.59 | 39.77,82.79 U$2.P$16 | 39.77,78.39 40.6,78.39 U$2.HS2 | U$2.HS2 43.47,78.39 43.57,78.29 42.47,78.29 U$2.HS2 | 44.77,79.59 43.67,78.49 42.27,78.49 U$2.HS2
  Bottom 1.016: 44.77,78.39 44.77,79.59 44.77,82.79 | 39.77,67.59 39.77,78.39 39.77,82.79
  Bottom 2.54: X1.1 45.38,92.61 38.71,85.94 38.71,80.28 40.6,78.39
OUTB2
  Bottom 0.68: 65.68,82.54 U$3.P$21 | 60.68,82.64 U$3.P$16 | U$3.P$15 60.68,68.04
  Bottom 1.016: 65.68,82.54 65.68,79.24 65.58,79.14 63.98,79.14 U$3.HS2 62.58,79.14 | 60.68,82.64 60.68,80.84 61.38,80.14 61.58,80.14 62.58,79.14 | 60.68,68.04 60.68,77.04 61.18,77.54 61.18,77.74 62.58,79.14
  Bottom 2.54: X1.3 60.02,92.54 59.75,92.27 59.75,81.96 U$3.HS2
RENA1
  Bottom 0.61: U$4.2 48.68,41.76 50.08,40.36 U$1.19
RENA2
  Bottom 0.61: U$5.2 68.89,41.92 65.32,38.35 U$1.7
RENB1
  Bottom 0.61: U$4.5 44.87,42.37 47.54,39.7 U$1.21
RENB2
  Bottom 0.61: U$5.4 66.35,41.98 64.17,39.8 62.14,39.8 60.26,37.92 60.26,36.4 U$1.11
RINA1
  Bottom 0.61: U$4.1 49.95,44.73 55.16,39.52 U$1.15
RINA2
  Bottom 0.61: U$5.1 70.16,40.1 67.86,37.8 U$1.5
RINB1
  Bottom 0.61: U$4.6 43.6,39.39 45,38 U$1.23
RINB2
  Bottom 0.61: U$5.5 65.08,43.65 63.08,41.66 60.47,41.66 57.7,38.89 U$1.13
RX
  Bottom 0.68: LED2.A 62.78,23.73 | 62.78,23.73 U$1.10 | 62.78,23.73 65.3,21.21 65.3,19.5 67.12,17.68 IC1.2
RXI
  Bottom 0.62: D1.A 71.91,19.07 D2.C
  Bottom 0.68: D2.C 71.91,8.6 70.54,7.23 R11.1 | 71.66,16.41 IC1.3
  Bottom 0.813: 71.86,16.7 D2.C 71.66,16.41
RXO
  Bottom 0.813: X2.3 54.69,5.29 56.9,7.5 66.4,7.5 R11.2
TAST0
  Bottom 0.68: U$6.17 11.31,35.31 16,40 LED17.C
  Bottom 0.813: R36.2 21.08,40.33 LED17.C 22.25,38.5 35,38.5 39.67,33.83 U$1.26
TAST1
  Bottom 0.406: 41.3,35.1 43.7,35.1
  Bottom 0.68: U$6.16 10.04,38.04 18,46 LED18.C
  Bottom 0.813: R38.2 20.75,47.67 LED18.C 20.8,46 22.3,44.5 31.9,44.5 41.3,35.1 | U$1.24 43.73,35.1 43.7,35.1
TAST2
  Bottom 0.68: U$6.18 13.18,34 LED19.C
  Bottom 0.813: R40.2 21.08,34.33 LED19.C 22.25,32.5 37.5,32.5 38.5,31.5 46,31.5 47.54,33.04 U$1.22
TAST3
  Bottom 0.68: U$6.15 8.77,31.73 9.5,31 20.08,31 R42.2
  Bottom 0.813: R42.2 21.08,28.33 LED20.C 21,28 22.5,26.5 32.5,26.5 35,29 48.5,29 52.62,33.12 U$1.18
TAST4
  Bottom 0.68: U$6.14 7.5,31 9,29.5 15.58,29.5 R44.2
  Bottom 0.813: R44.2 20.75,23.67 LED21.C 21,22 22.5,20.5 32.5,20.5 39.8,27.8 49.13,27.8 U$1.16
TAST5
  Bottom 0.68: U$6.13 6.23,30.27 8.5,28 14.5,28 17.5,25 17.5,21.58 R46.2
  Bottom 0.813: R46.2 21.08,16.33 LED22.C 20.75,15.75 22,14.5 32,14.5 43.1,25.6 52.01,25.6 U$1.12
TX
  Bottom 0.38: 62,35.1 64.05,35.1 | 61.5,32.4 61.5,34.6
  Bottom 0.406: 61.5,34.6 62,35.1
  Bottom 0.68: U$1.8 | 61.5,32.4 61.5,32.3 61.5,31.7 55.7,25.9 55.7,19.2 54.6,18.11 IC2.3
  Bottom 0.813: 64.05,35.1 U$1.8
TXO
  Bottom 0.68: 52.12,19.38 IC2.2 47.88,19.38 46.6,18.1 46.6,7.92 X2.2
  Bottom 0.813: 52.12,19.38 LED1.A